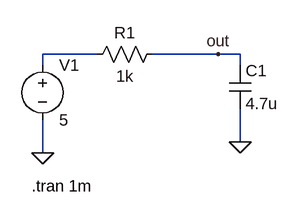
[diagram p0: schematic symbol_attributes.asc]
symbol_attributes.asc, the LTspice schematic file:
Version 4.1
SHEET 1 880 680
WIRE 32 128 -48 128
WIRE 208 128 112 128
WIRE 240 128 208 128
WIRE -48 144 -48 128
WIRE 240 144 240 128
WIRE 240 256 240 208
WIRE -48 272 -48 224
FLAG 240 256 0
FLAG -48 272 0
FLAG 208 128 out
SYMBOL voltage -48 128 R0
WINDOW 123 0 0 Left 2
WINDOW 39 0 0 Left 2
SYMATTR Value2 ""
SYMATTR SpiceLine ""
SYMATTR InstName V1
SYMATTR Value 5
SYMBOL res 128 112 R90
WINDOW 0 0 56 VBottom 2
WINDOW 3 32 56 VTop 2
SYMATTR Value 1k
SYMATTR InstName R1
SYMBOL cap 224 144 R0
SYMATTR SpiceLine Rser=1m
SYMATTR Value 4.7u
SYMATTR InstName C1
TEXT -64 320 Left 2 !.tran 1m

The netlist it stands for:
* symbol_attributes.asc
V1 N001 0 5
R1 out N001 1k
C1 out 0 4.7u Rser=1m
.tran 1m
.backanno
.end